# Altium schematic sheet 遥控原理图（AD打开）.SchDoc
size A3
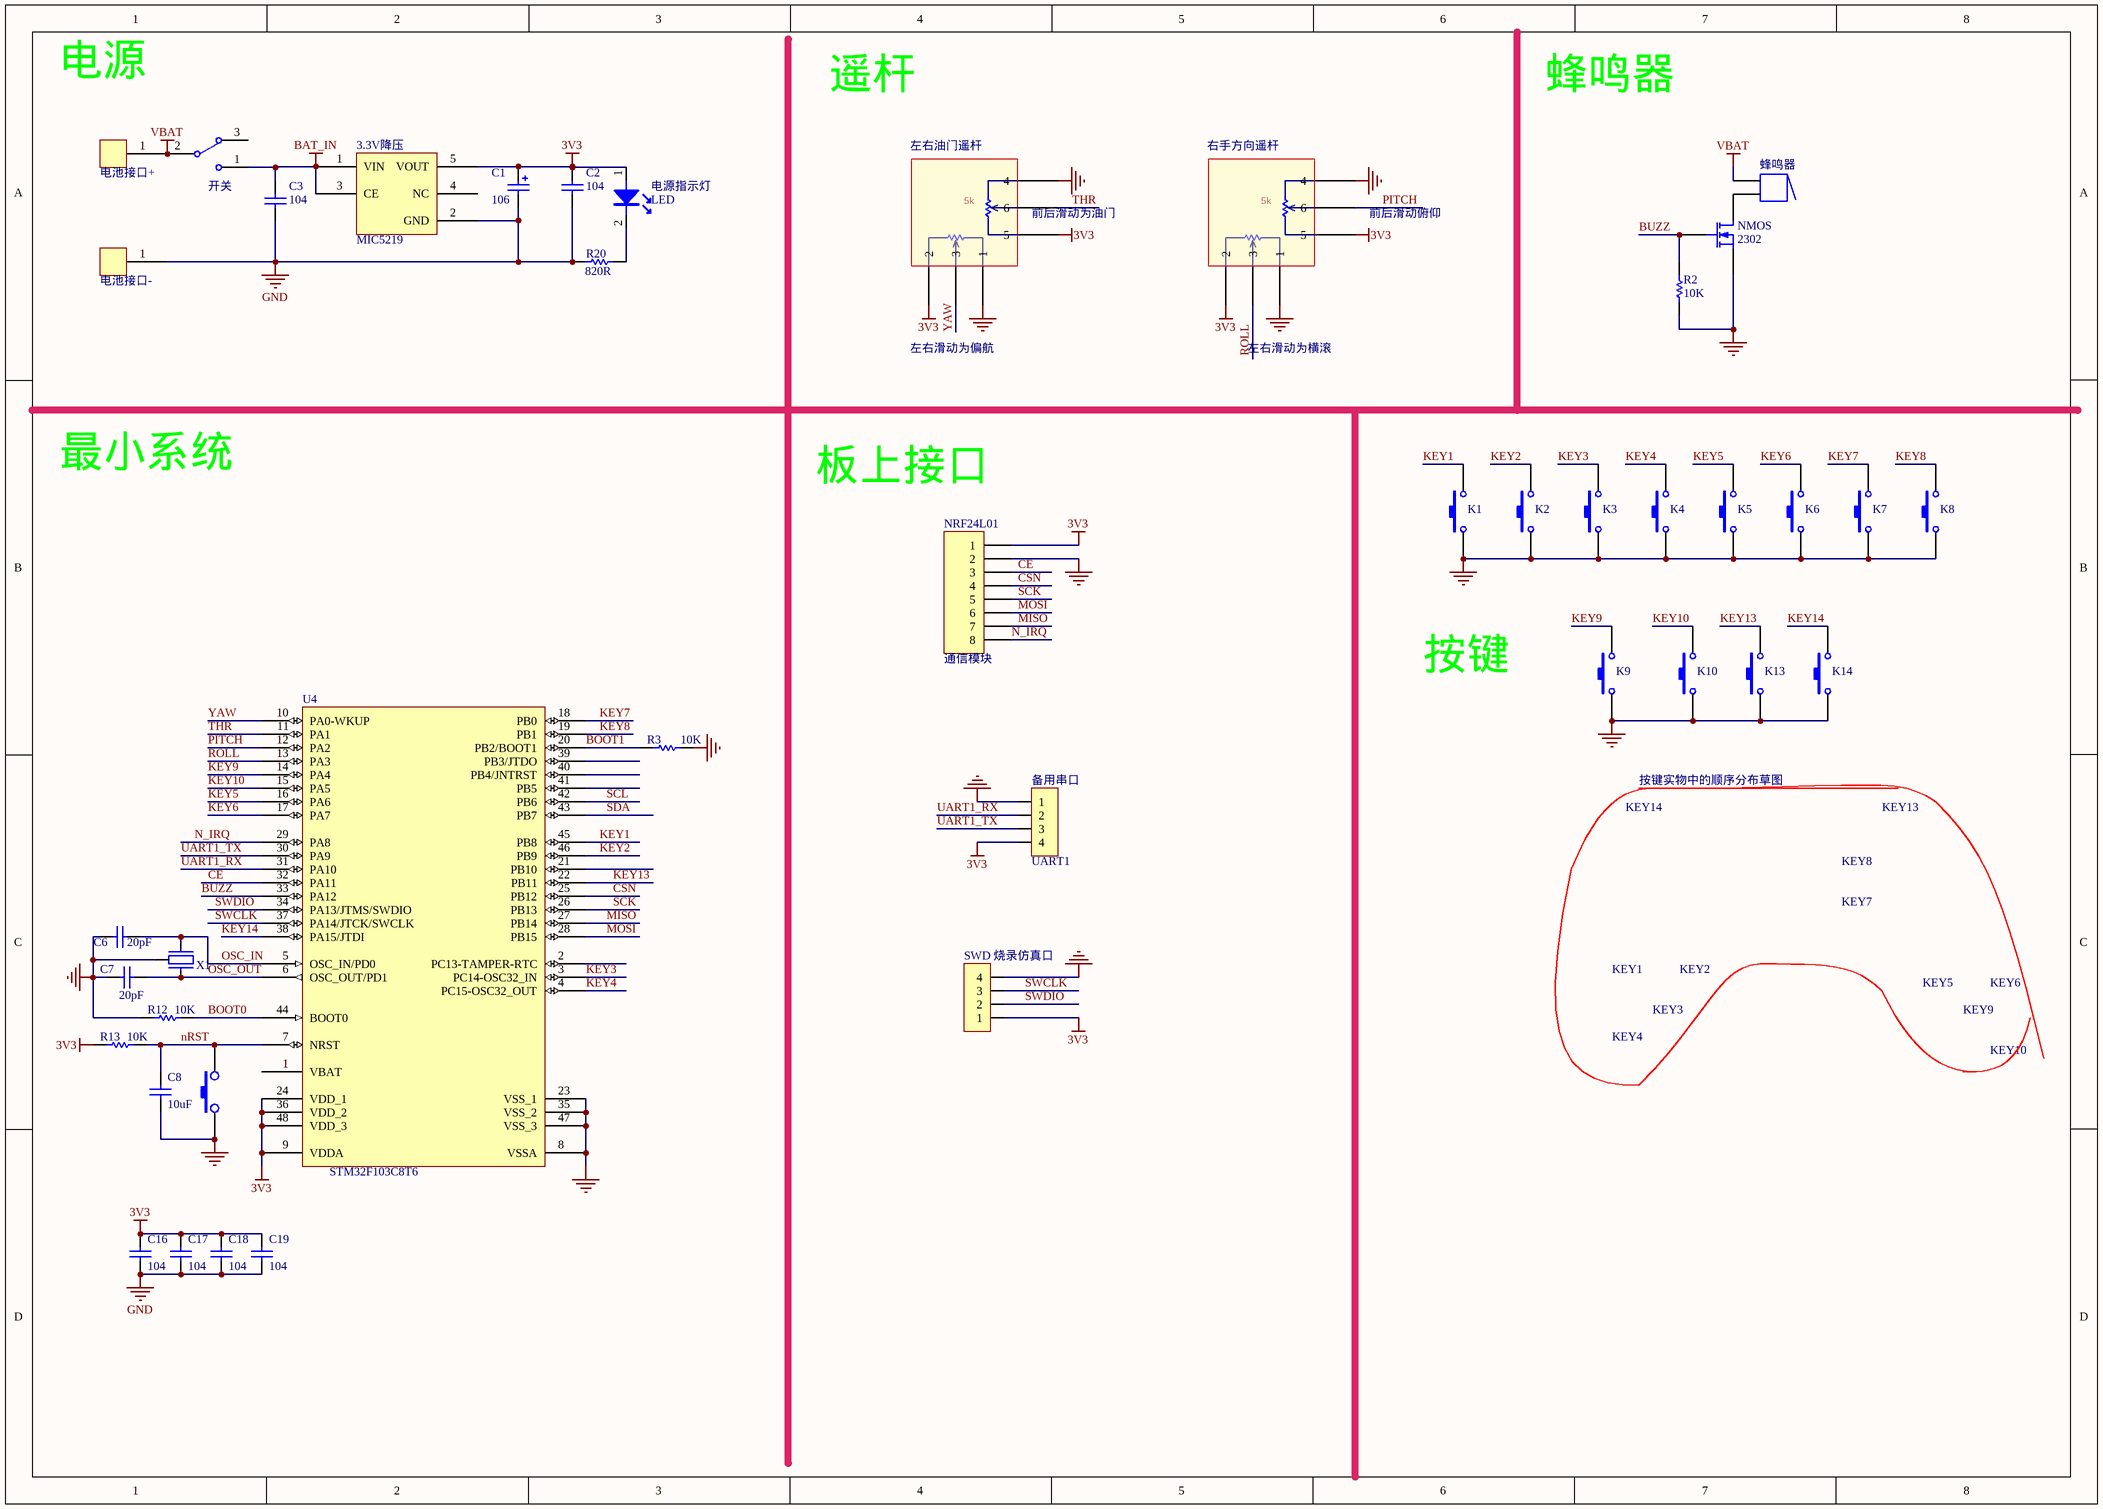
[diagram p0: 遥控原理图（AD打开）.SchDoc]

## Parts
3.3V降压  MIC5219  [SOT23-5]
C1  value 106  [1206]  (hidden comment: Cap Tan A)
C2  value 104  [1206_C]  (hidden comment: Cap Chip 1206)
C3  value 104  [0603_C]  (hidden comment: Cap Chip 1206)
C6  20pF  [0603_C]
C7  20pF  [0603_C]
C8  10uF  [0603_C]
C16  104  [0603_C]
C17  104  [0603_C]
C18  104  [0603_C]
C19  104  [0603_C]
K1  40%（油門上限）  [4脚贴片点动开关]  (value not drawn)
K2  60%  [4脚贴片点动开关]  (value not drawn)
K3  40%（油門上限）  [4脚贴片点动开关]  (value not drawn)
K4  60%  [4脚贴片点动开关]  (value not drawn)
K5  40%（油門上限）  [4脚贴片点动开关]  (value not drawn)
K6  60%  [4脚贴片点动开关]  (value not drawn)
K7  40%（油門上限）  [4脚贴片点动开关]  (value not drawn)
K8  60%  [4脚贴片点动开关]  (value not drawn)
K9  40%（油門上限）  [4脚贴片点动开关]  (value not drawn)
K10  60%  [4脚贴片点动开关]  (value not drawn)
K13  40%（油門上限）  [侧贴侧按点动开关]  (value not drawn)
K14  60%  [侧贴侧按点动开关]  (value not drawn)
NMOS  2302  [SOT-23-3]
NRF24L01  通信模块  [HDR1X8]
R2  value 10K  [0603_R]  (hidden comment: 222)
R3  value 10K  [0603_R]  (hidden comment: Res1)
R12  value 10K  [0603_R]  (hidden comment: Res1)
R13  value 10K  [0603_R]  (hidden comment: Res1)
R20  value 820R  [0603_R]  (hidden comment: 222)
REST1  SW-PB  [SW-2]  (value not drawn)
SWD_烧录仿真口  SWD  [1.27侧卧表贴]  (value not drawn)
U4  STM32F103C8T6  [LQFP48]
X1  XTAL_SMT  [村田陶瓷晶振]  (value not drawn)
右手方向遥杆  摇杆  [遥控电位器]  (value not drawn)
备用串口  UART1  [1.27侧卧表贴]
左右油门遥杆  摇杆  [遥控电位器]  (value not drawn)
开关  SW-SPDT  [SW-5]  (value not drawn)
电池接口+  Header 1  [BAT]  (value not drawn)
电池接口-  Header 1  [BAT]  (value not drawn)
电源指示灯  LED  [0603_LED]
蜂鸣器  Buzzer  [蜂鸣器9mm]  (value not drawn)

## Nets
3V3: 3.3V降压.5(VOUT) C1.2 C2.1 C16.1 C17.1 C18.1 C19.1 NRF24L01.1 R13.2 SWD_烧录仿真口.1 U4.9(VDDA) U4.24(VDD_1) U4.36(VDD_2) U4.48(VDD_3) 右手方向遥杆.2 右手方向遥杆.5 备用串口.4 左右油门遥杆.2 左右油门遥杆.5 电源指示灯.1
BAT_IN: 3.3V降压.1(VIN) 3.3V降压.3(CE) C3.1 开关.1
GND: 3.3V降压.2(GND) C1.1 C2.2 C3.2 C6.2 C7.2 C8.2 C16.2 C17.2 C18.2 C19.2 K1.1 K2.1 K3.1 K4.1 K5.1 K6.1 K7.1 K8.1 K9.1 K10.1 K13.1 K14.1 NMOS.3(S) NRF24L01.2 R2.2 R3.1 R12.2 R20.1 REST1.1 SWD_烧录仿真口.4 U4.8(VSSA) U4.23(VSS_1) U4.35(VSS_2) U4.47(VSS_3) X1.0 右手方向遥杆.1 右手方向遥杆.4 备用串口.1 左右油门遥杆.1 左右油门遥杆.4 电池接口-.1
VBAT: 开关.2 电池接口+.1 蜂鸣器.2
BOOT0: R12.1 U4.44(BOOT0)
BOOT1: R3.2 U4.20(PB2/BOOT1)
BUZZ: NMOS.2(G) R2.1 U4.33(PA12)
CE: NRF24L01.3 U4.32(PA11)
CSN: NRF24L01.4 U4.25(PB12)
KEY1: K1.2 U4.45(PB8)
KEY2: K2.2 U4.46(PB9)
KEY3: K3.2 U4.3(PC14-OSC32_IN)
KEY4: K4.2 U4.4(PC15-OSC32_OUT)
KEY5: K5.2 U4.16(PA6)
KEY6: K6.2 U4.17(PA7)
KEY7: K7.2 U4.18(PB0)
KEY8: K8.2 U4.19(PB1)
KEY9: K9.2 U4.14(PA4)
KEY10: K10.2 U4.15(PA5)
KEY13: K13.2 U4.22(PB11)
KEY14: K14.2 U4.38(PA15/JTDI)
MISO: NRF24L01.7 U4.27(PB14)
MOSI: NRF24L01.6 U4.28(PB15)
N_IRQ: NRF24L01.8 U4.29(PA8)
nRST: C8.1 R13.1 REST1.2 U4.7(NRST)
OSC_IN: C6.1 U4.5(OSC_IN/PD0) X1.2
OSC_OUT: C7.1 U4.6(OSC_OUT/PD1) X1.1
PITCH: U4.12(PA2) 右手方向遥杆.6
ROLL: U4.13(PA3) 右手方向遥杆.3
SCK: NRF24L01.5 U4.26(PB13)
SCL: U4.42(PB6)
SDA: U4.43(PB7)
SWCLK: SWD_烧录仿真口.3 U4.37(PA14/JTCK/SWCLK)
SWDIO: SWD_烧录仿真口.2 U4.34(PA13/JTMS/SWDIO)
THR: U4.11(PA1) 左右油门遥杆.6
UART1_RX: U4.31(PA10) 备用串口.2
UART1_TX: U4.30(PA9) 备用串口.3
YAW: U4.10(PA0-WKUP) 左右油门遥杆.3
NetNMOS_1: NMOS.1(D) 蜂鸣器.1
NetR20_2: R20.2 电源指示灯.2

Not connected (* = marked no-connect by the designer): 3.3V降压 4(NC); U4 1(VBAT) 2(PC13-TAMPER-RTC) 21(PB10) 39(PB3/JTDO) 40(PB4/JNTRST) 41(PB5); 开关 3

## Notes on the sheet
- 电源
- 遥杆
- 蜂鸣器
- (near 左右油门遥杆) 5k
- (near 左右油门遥杆) 前后滑动为油门
- (near 右手方向遥杆) 5k
- 前后滑动俯仰
- 左右滑动为偏航
- 左右滑动为横滚
- 最小系统
- 板上接口
- 按键
- 按键实物中的顺序分布草图
- KEY14
- KEY13
- KEY8
- KEY7
- KEY1
- KEY2
- KEY5
- KEY6
- KEY4
- KEY3
- KEY9
- KEY10

## Library data of the parts
3.3V降压 = HT7X33
C1 = Cap Tan A: Polarized Capacitor (Radial); Voltage: 16V; Published: 8-Jun-2000; Revision: July-2002: Re-released for DXP Platform.; Publisher: Altium Limited
C2 C3 = Cap Chip 1206: Polarized Capacitor (Radial); Published: 8-Jun-2000; Revision: July-2002: Re-released for DXP Platform.; Publisher: Altium Limited
C6-C8 C16-C19 = C0603
K1-K10 K13 K14 = SW-PB: Switch; Published: 24-Mar-1999; LatestRevisionDate: 17-Jul-2002; LatestRevisionNote: Re-released for DXP Platform.; PackageReference: SPST-2; Publisher: Altium Limited; PackageDescription: Switch; 2 Leads
NMOS = MOSFET-N: N-Channel MOSFET; Published: 8-Jun-2000; LatestRevisionDate: 17-Jul-2002; LatestRevisionNote: Re-released for DXP Platform.; PackageVersion: 1995/1996; PackageReference: E3; Publisher: Altium Limited; PackageDescription: TO, Flat Index; 3 In-Line, Axial Leads; Body Dia. 4.6mm; Lead Dia. 0.5 mm (max)
NRF24L01 = Header 8: Header, 8-Pin; LatestRevisionDate: 17-Jul-2002; LatestRevisionNote: Re-released for DXP Platform.; Publisher: Altium Limited
R2 R3 R12 R13 R20 = Res1: Resistor; Published: 8-Jun-2000; LatestRevisionDate: 17-Jul-2002; LatestRevisionNote: Re-released for DXP Platform.; Publisher: Altium Limited; PackageDescription: Axial Device, Thru-Hole; 2 Leads; 0.3 in Pin Spacing
  R2 R20: PackageReference: AXIAL-0.3
  R3 R12 R13: PackageReference: 0603_R
SWD_烧录仿真口 备用串口 = Header 4H: Header, 4-Pin, Right Angle; LatestRevisionDate: 17-Jul-2002; LatestRevisionNote: Re-released for DXP Platform.; Publisher: Altium Limited
开关 = SW-SPDT: SPDT Subminiature Toggle Switch, Right Angle Mounting, Vertical Actuation; Published: 24-Mar-1999; LatestRevisionDate: 17-Dec-2003; LatestRevisionNote: Schematic revised, PCB Footprint replaced.; DatasheetVersion: 05-Dec-2000; PackageReference: TL36WW15050; Publisher: Altium Limited; PackageDescription: Switch; 4 Leads; ComponentLink1Description: Manufacturer Link; ComponentLink1URL: http://www.apem.com
蜂鸣器 = Buzzer: Magnetic Transducer Buzzer; Published: 24-Mar-1999; LatestRevisionDate: 17-Dec-2003; LatestRevisionNote: Schematic revised, PCB Footprint replaced.; DatasheetVersion: 17-Dec-2003; PackageReference: ABSM-1574; Publisher: Altium Limited; PackageDescription: Magnetic Transducer Buzzer; ComponentLink1Description: Manufacturer Link; ComponentLink1URL: http://www.megastar.com/linecard/buzzmode/index.php